# Altium schematic sheet 5DPD8_v1.0_OS_Sheet2.SchDoc: 5DPD8 Controller
size A4; Date: 10th Mar 14; CheckedBy: J. Wong/C. Lai; CompanyName: Makible Ltd.; DrawnBy: Martyn Kay; Engineer: Martyn Kay; Revision: 1.0; SheetNumber: 2; SheetTotal: 4; Website: 5DPrint.com; DesignFileLink: D8 Design Files; BasedOn: Printrboard Rev. B; OSHWLicense: CC BY-SA 4.0
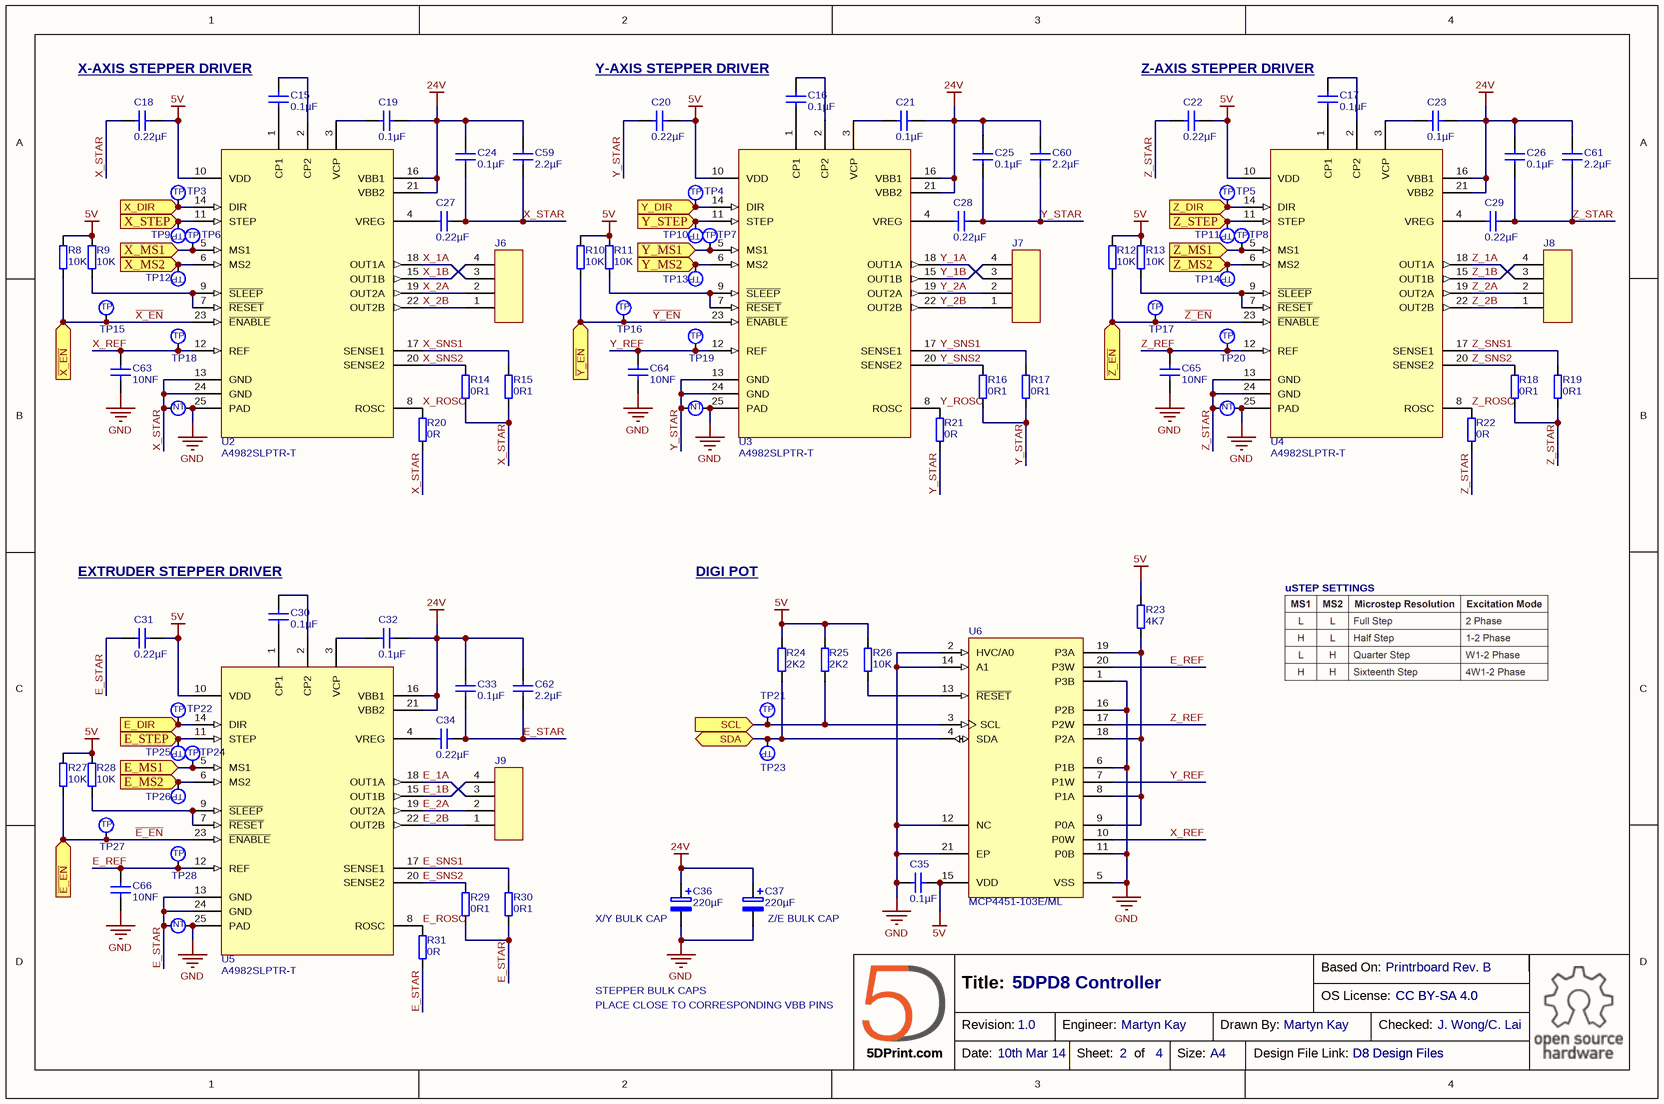
[diagram p0: 5DPD8_v1.0_OS_Sheet2.SchDoc]

## Parts
C15  0.1µF  [CAPC0603(1608)100_N]
C16  0.1µF  [CAPC0603(1608)100_N]
C17  0.1µF  [CAPC0603(1608)100_N]
C18  0.22µF  [CAPC0603(1608)100_N]
C19  0.1µF  [CAPC0603(1608)100_N]
C20  0.22µF  [CAPC0603(1608)100_N]
C21  0.1µF  [CAPC0603(1608)100_N]
C22  0.22µF  [CAPC0603(1608)100_N]
C23  0.1µF  [CAPC0603(1608)100_N]
C24  0.1µF  [CAPC0603(1608)100_N]
C25  0.1µF  [CAPC0603(1608)100_N]
C26  0.1µF  [CAPC0603(1608)100_N]
C27  0.22µF  [CAPC0603(1608)100_N]
C28  0.22µF  [CAPC0603(1608)100_N]
C29  0.22µF  [CAPC0603(1608)100_N]
C30  0.1µF  [CAPC0603(1608)100_N]
C31  0.22µF  [CAPC0603(1608)100_N]
C32  0.1µF  [CAPC0603(1608)100_N]
C33  0.1µF  [CAPC0603(1608)100_N]
C34  0.22µF  [CAPC0603(1608)100_N]
C35  0.1µF  [CAPC0603(1608)100_N]
C36  220µF  [CAPRAD8X11.5]
C37  220µF  [CAPRAD8X11.5]
C59  2.2µF  [CAPC0805(2012)145_N]
C60  2.2µF  [CAPC0805(2012)145_N]
C61  2.2µF  [CAPC0805(2012)145_N]
C62  2.2µF  [CAPC0805(2012)145_N]
C63  10NF  [CAPC0603(1608)100_N]
C64  10NF  [CAPC0603(1608)100_N]
C65  10NF  [CAPC0603(1608)100_N]
C66  10NF  [CAPC0603(1608)100_N]
J6  0022272041  [MOLEX_22-27-2041]  (value not drawn)
J7  0022272041  [MOLEX_22-27-2041]  (value not drawn)
J8  0022272041  [MOLEX_22-27-2041]  (value not drawn)
J9  0022272041  [MOLEX_22-27-2041]  (value not drawn)
NT2  NET_TIE  [NET_TIE-PAD]  (value not drawn)  (net tie, no BOM)
NT3  NET_TIE  [NET_TIE-PAD]  (value not drawn)  (net tie, no BOM)
NT4  NET_TIE  [NET_TIE-PAD]  (value not drawn)  (net tie, no BOM)
NT5  NET_TIE  [NET_TIE-PAD]  (value not drawn)  (net tie, no BOM)
R8  10K  [RESC0603(1608)_N]
R9  10K  [RESC0603(1608)_N]
R10  10K  [RESC0603(1608)_N]
R11  10K  [RESC0603(1608)_N]
R12  10K  [RESC0603(1608)_N]
R13  10K  [RESC0603(1608)_N]
R14  0R1  [RESC0805(2012)_L]
R15  0R1  [RESC0805(2012)_L]
R16  0R1  [RESC0805(2012)_L]
R17  0R1  [RESC0805(2012)_L]
R18  0R1  [RESC0805(2012)_L]
R19  0R1  [RESC0805(2012)_L]
R20  0R  [RESC0603(1608)_N]
R21  0R  [RESC0603(1608)_N]
R22  0R  [RESC0603(1608)_N]
R23  4K7  [RESC0603(1608)_N]
R24  2K2  [RESC0603(1608)_N]
R25  2K2  [RESC0603(1608)_N]
R26  10K  [RESC0603(1608)_N]
R27  10K  [RESC0603(1608)_N]
R28  10K  [RESC0603(1608)_N]
R29  0R1  [RESC0805(2012)_L]
R30  0R1  [RESC0805(2012)_L]
R31  0R  [RESC0603(1608)_N]
TP3  TESTPOINT  [TESTPOINT]  (value not drawn)  (no BOM)
TP4  TESTPOINT  [TESTPOINT]  (value not drawn)  (no BOM)
TP5  TESTPOINT  [TESTPOINT]  (value not drawn)  (no BOM)
TP6  TESTPOINT  [TESTPOINT]  (value not drawn)  (no BOM)
TP7  TESTPOINT  [TESTPOINT]  (value not drawn)  (no BOM)
TP8  TESTPOINT  [TESTPOINT]  (value not drawn)  (no BOM)
TP9  TESTPOINT  [TESTPOINT]  (value not drawn)  (no BOM)
TP10  TESTPOINT  [TESTPOINT]  (value not drawn)  (no BOM)
TP11  TESTPOINT  [TESTPOINT]  (value not drawn)  (no BOM)
TP12  TESTPOINT  [TESTPOINT]  (value not drawn)  (no BOM)
TP13  TESTPOINT  [TESTPOINT]  (value not drawn)  (no BOM)
TP14  TESTPOINT  [TESTPOINT]  (value not drawn)  (no BOM)
TP15  TESTPOINT  [TESTPOINT]  (value not drawn)  (no BOM)
TP16  TESTPOINT  [TESTPOINT]  (value not drawn)  (no BOM)
TP17  TESTPOINT  [TESTPOINT]  (value not drawn)  (no BOM)
TP18  TESTPOINT  [TESTPOINT]  (value not drawn)  (no BOM)
TP19  TESTPOINT  [TESTPOINT]  (value not drawn)  (no BOM)
TP20  TESTPOINT  [TESTPOINT]  (value not drawn)  (no BOM)
TP21  TESTPOINT  [TESTPOINT]  (value not drawn)  (no BOM)
TP22  TESTPOINT  [TESTPOINT]  (value not drawn)  (no BOM)
TP23  TESTPOINT  [TESTPOINT]  (value not drawn)  (no BOM)
TP24  TESTPOINT  [TESTPOINT]  (value not drawn)  (no BOM)
TP25  TESTPOINT  [TESTPOINT]  (value not drawn)  (no BOM)
TP26  TESTPOINT  [TESTPOINT]  (value not drawn)  (no BOM)
TP27  TESTPOINT  [TESTPOINT]  (value not drawn)  (no BOM)
TP28  TESTPOINT  [TESTPOINT]  (value not drawn)  (no BOM)
U2  A4982SLPTR-T  [TSOP65P640X120_HS-25N]
U3  A4982SLPTR-T  [TSOP65P640X120_HS-25N]
U4  A4982SLPTR-T  [TSOP65P640X120_HS-25N]
U5  A4982SLPTR-T  [TSOP65P640X120_HS-25N]
U6  MCP4451-103E/ML  [QFN-ML20_N]

## Ports
E_DIR (in), E_MS1 (in), E_MS2 (in), E_STEP (in), SCL (in), SDA (bidir), X_DIR (in), X_MS1 (in), X_MS2 (in), X_STEP (in), Y_DIR (in), Y_MS1 (in), Y_MS2 (in), Y_STEP (in), Z_DIR (in), Z_MS1 (in), Z_MS2 (in), Z_STEP (in), ~{E_EN} (in), ~{X_EN} (in), ~{Y_EN} (in), ~{Z_EN} (in)

## Nets
5V: C18.2 C20.2 C22.2 C31.2 C35.2 R8.2 R9.2 R10.2 R11.2 R12.2 R13.2 R23.2 R24.2 R25.2 R26.2 R27.2 R28.2 U2.10(VDD) U3.10(VDD) U4.10(VDD) U5.10(VDD) U6.15(VDD)
24V: C19.1 C21.1 C23.1 C24.2 C25.2 C26.2 C32.1 C33.2 C36.1(+) C37.1(+) C59.2 C60.2 C61.2 C62.2 U2.16(VBB1) U2.21(VBB2) U3.16(VBB1) U3.21(VBB2) U4.16(VBB1) U4.21(VBB2) U5.16(VBB1) U5.21(VBB2)
GND: C35.1 C36.2(-) C37.2(-) C63.1 C64.1 C65.1 C66.1 NT2.2 NT3.2 NT4.2 NT5.2 U2.25(PAD) U3.25(PAD) U4.25(PAD) U5.25(PAD) U6.1(P3B) U6.2(HVC/A0) U6.5(VSS) U6.6(P1B) U6.11(P0B) U6.12(NC) U6.14(A1) U6.16(P2B) U6.21(EP)
~{E_EN}: R27.1 TP27.1 U5.23(~{ENABLE}) ; port ~{E_EN}
E_1A: J9.3 U5.18(OUT1A)
E_1B: J9.4 U5.15(OUT1B)
E_2A: J9.2 U5.19(OUT2A)
E_2B: J9.1 U5.22(OUT2B)
E_DIR: TP22.1 U5.14(DIR) ; port E_DIR
E_MS1: TP24.1 U5.5(MS1) ; port E_MS1
E_MS2: TP26.1 U5.6(MS2) ; port E_MS2
E_REF: C66.2 TP28.1 U5.12(REF) U6.20(P3W)
E_ROSC: R31.2 U5.8(ROSC)
E_SNS1: R30.2 U5.17(SENSE1)
E_SNS2: R29.2 U5.20(SENSE2)
E_STAR: C31.1 C33.1 C34.2 C62.1 NT5.1 R29.1 R30.1 R31.1 U5.13(GND) U5.24(GND)
E_STEP: TP25.1 U5.11(STEP) ; port E_STEP
SCL: R25.1 TP21.1 U6.3(SCL) ; port SCL
SDA: R24.1 TP23.1 U6.4(SDA) ; port SDA
~{X_EN}: R8.1 TP15.1 U2.23(~{ENABLE}) ; port ~{X_EN}
X_1A: J6.3 U2.18(OUT1A)
X_1B: J6.4 U2.15(OUT1B)
X_2A: J6.2 U2.19(OUT2A)
X_2B: J6.1 U2.22(OUT2B)
X_DIR: TP3.1 U2.14(DIR) ; port X_DIR
X_MS1: TP6.1 U2.5(MS1) ; port X_MS1
X_MS2: TP12.1 U2.6(MS2) ; port X_MS2
X_REF: C63.2 TP18.1 U2.12(REF) U6.10(P0W)
X_ROSC: R20.2 U2.8(ROSC)
X_SNS1: R15.2 U2.17(SENSE1)
X_SNS2: R14.2 U2.20(SENSE2)
X_STAR: C18.1 C24.1 C27.2 C59.1 NT2.1 R14.1 R15.1 R20.1 U2.13(GND) U2.24(GND)
X_STEP: TP9.1 U2.11(STEP) ; port X_STEP
~{Y_EN}: R10.1 TP16.1 U3.23(~{ENABLE}) ; port ~{Y_EN}
Y_1A: J7.3 U3.18(OUT1A)
Y_1B: J7.4 U3.15(OUT1B)
Y_2A: J7.2 U3.19(OUT2A)
Y_2B: J7.1 U3.22(OUT2B)
Y_DIR: TP4.1 U3.14(DIR) ; port Y_DIR
Y_MS1: TP7.1 U3.5(MS1) ; port Y_MS1
Y_MS2: TP13.1 U3.6(MS2) ; port Y_MS2
Y_REF: C64.2 TP19.1 U3.12(REF) U6.7(P1W)
Y_ROSC: R21.2 U3.8(ROSC)
Y_SNS1: R17.2 U3.17(SENSE1)
Y_SNS2: R16.2 U3.20(SENSE2)
Y_STAR: C20.1 C25.1 C28.2 C60.1 NT3.1 R16.1 R17.1 R21.1 U3.13(GND) U3.24(GND)
Y_STEP: TP10.1 U3.11(STEP) ; port Y_STEP
~{Z_EN}: R12.1 TP17.1 U4.23(~{ENABLE}) ; port ~{Z_EN}
Z_1A: J8.3 U4.18(OUT1A)
Z_1B: J8.4 U4.15(OUT1B)
Z_2A: J8.2 U4.19(OUT2A)
Z_2B: J8.1 U4.22(OUT2B)
Z_DIR: TP5.1 U4.14(DIR) ; port Z_DIR
Z_MS1: TP8.1 U4.5(MS1) ; port Z_MS1
Z_MS2: TP14.1 U4.6(MS2) ; port Z_MS2
Z_REF: C65.2 TP20.1 U4.12(REF) U6.17(P2W)
Z_ROSC: R22.2 U4.8(ROSC)
Z_SNS1: R19.2 U4.17(SENSE1)
Z_SNS2: R18.2 U4.20(SENSE2)
Z_STAR: C22.1 C26.1 C29.2 C61.1 NT4.1 R18.1 R19.1 R22.1 U4.13(GND) U4.24(GND)
Z_STEP: TP11.1 U4.11(STEP) ; port Z_STEP
NetC15_1: C15.1 U2.2(CP2)
NetC15_2: C15.2 U2.1(CP1)
NetC16_1: C16.1 U3.2(CP2)
NetC16_2: C16.2 U3.1(CP1)
NetC17_1: C17.1 U4.2(CP2)
NetC17_2: C17.2 U4.1(CP1)
NetC19_2: C19.2 U2.3(VCP)
NetC21_2: C21.2 U3.3(VCP)
NetC23_2: C23.2 U4.3(VCP)
NetC27_1: C27.1 U2.4(VREG)
NetC28_1: C28.1 U3.4(VREG)
NetC29_1: C29.1 U4.4(VREG)
NetC30_1: C30.1 U5.2(CP2)
NetC30_2: C30.2 U5.1(CP1)
NetC32_2: C32.2 U5.3(VCP)
NetC34_1: C34.1 U5.4(VREG)
NetR9_1: R9.1 U2.7(~{RESET}) U2.9(~{SLEEP})
NetR11_1: R11.1 U3.7(~{RESET}) U3.9(~{SLEEP})
NetR13_1: R13.1 U4.7(~{RESET}) U4.9(~{SLEEP})
NetR23_1: R23.1 U6.8(P1A) U6.9(P0A) U6.18(P2A) U6.19(P3A)
NetR26_1: R26.1 U6.13(~{RESET})
NetR28_1: R28.1 U5.7(~{RESET}) U5.9(~{SLEEP})

## Notes on the sheet
- X-AXIS STEPPER DRIVER
- Y-AXIS STEPPER DRIVER
- Z-AXIS STEPPER DRIVER
- EXTRUDER STEPPER DRIVER
- DIGI POT
- uSTEP SETTINGS
- (near C36) X/Y BULK CAP
- (near C37) Z/E BULK CAP
- PLACE CLOSE TO CORRESPONDING VBB PINS
- STEPPER BULK CAPS
- Based On:
- Title:
- Revision:
- Engineer:
- Drawn By:
- OS License:
- Checked:
- Date:
- Sheet:
- of
- Size:
- A4
- Design File Link:
- (in symbol NET_TIE) NT
- (in symbol TESTPOINT) TP

## Library data of the parts
C15-C17 C19 C21 C23-C26 C30 C32 C33 C35 = C0603-0.1UF-50V-10%-X7R: CAP CER 0.1UF 50V 10% X7R 0603; Manufacturer: Yageo; ManufacturerPartNumber: CC0603KRX7R9BB104; Supplier 1: Digi-Key; RoHS: RoHS Compliant; Category: Capacitors; Stock 1: 2096000; Pricing 1: 4000=0.00513, 8000=0.00468, 12000=0.00446, 28000=0.00424, 100000=0.00307 (USD); Packaging: Tape & Reel (TR); Capacitance: 0.1µF; Voltage - Rated: 50V; Tolerance: ±10%; Temperature Coefficient: X7R; Mounting Type: Surface Mount, MLCC; Operating Temperature: -55°C ~ 125°C; Applications: General Purpose; Ratings: -; Package / Case: 0603 (1608 Metric); Size / Dimension: 0.063" L x 0.031" W (1.60mm x 0.80mm); Height - Seated (Max): -; Thickness (Max): 0.035" (0.90mm); Lead Spacing: -; Features: -; Lead Style: -; ComponentLink1URL: http://www.yageo.com/documents/recent/UPY-GPHC_X7R_6.3V-to-50V_8.pdf; ComponentLink1Description: http://www.yageo.com/documents/recent/UPY-GPHC_X7R_6.3V-to-50V_8.pdf; Supplier Part Number 1: 311-1344-2-ND
C18 C20 C22 C27-C29 C31 C34 = C0603-0.22UF-50V-10%-X7R: CAP CER 0.22UF 50V 10% X7R 0603; Manufacturer: TDK Corporation; ManufacturerPartNumber: C1608X7R1H224K080AB; Supplier 1: Digi-Key; RoHS: RoHS Compliant; Category: Capacitors; Stock 1: 116000; Pricing 1: 4000=0.03, 8000=0.0285, 12000=0.027, 28000=0.0255, 100000=0.02025 (USD); Packaging: Tape & Reel (TR); Capacitance: 0.22µF; Voltage - Rated: 50V; Tolerance: ±10%; Temperature Coefficient: X7R; Mounting Type: Surface Mount, MLCC; Operating Temperature: -55°C ~ 125°C; Applications: General Purpose; Ratings: -; Package / Case: 0603 (1608 Metric); Size / Dimension: 0.063" L x 0.031" W (1.60mm x 0.80mm); Height - Seated (Max): -; Thickness (Max): 0.035" (0.90mm); Lead Spacing: -; Features: -; Lead Style: -; ComponentLink1URL: http://product.tdk.com/capacitor/mlcc/en/documents/mlcc_commercial_general_en.pdf; ComponentLink1Description: http://product.tdk.com/capacitor/mlcc/en/documents/mlcc_commercial_general_en.pdf; Supplier Part Number 1: 445-7408-2-ND
C36 C37 = CAP_RAD-ALU-220UF-35V-20%: CAP ALUM 220UF 35V 20% RADIAL; Manufacturer: Rubycon; ManufacturerPartNumber: 35ZLH220MEFC8X11.5; Lifetime @ Temp.: 8000 Hrs @ 105°C; Ripple Current: 945mA; Impedance: 56 mOhm; Supplier 1: Digi-Key; RoHS: RoHS Compliant; Category: Capacitors; Stock 1: 40821; Pricing 1: 1=0.41, 10=0.288, 25=0.2456, 50=0.2176, 100=0.1895, 250=0.16148, 500=0.1404, 1000=0.11934, 2500=0.11232 (USD); Packaging: Bulk; Capacitance: 220µF; Voltage Rating: 35V; Tolerance: ±20%; ESR (Equivalent Series Resistance): -; Operating Temperature: -40°C ~ 105°C; Type: -; Applications: General Purpose; Lead Spacing: 0.138" (3.50mm); Size / Dimension: 0.315" Dia (8.00mm); Height - Seated (Max): 0.512" (13.00mm); Surface Mount Land Size: -; Mounting Type: Through Hole; Package / Case: Radial, Can; ComponentLink1URL: http://www.rubycon.co.jp/EN/CATALOG/E_PDFS/ALUMINUM/E_ZLH.PDF; ComponentLink1Description: http://www.rubycon.co.jp/EN/CATALOG/E_PDFS/ALUMINUM/E_ZLH.PDF; Supplier Part Number 1: 1189-1863-ND
C59-C62 = C0805-2.2UF-50V-10%-X7R: CAP CER 2.2UF 50V 10% X7R 0805; Manufacturer: Taiyo Yuden; ManufacturerPartNumber: UMK212BB7225KG-T; Supplier 1: Digi-Key; RoHS: RoHS Compliant; Category: Capacitors; Stock 1: 0; Pricing 1: 3000=0.05, 6000=0.04625, 9000=0.04375, 15000=0.0415, 30000=0.04, 75000=0.0375, 150000=0.03313 (USD); Packaging: Tape & Reel (TR); Capacitance: 2.2µF; Voltage - Rated: 50V; Tolerance: ±10%; Temperature Coefficient: X7R; Mounting Type: Surface Mount, MLCC; Operating Temperature: -55°C ~ 125°C; Applications: General Purpose; Ratings: -; Package / Case: 0805 (2012 Metric); Size / Dimension: 0.079" L x 0.049" W (2.00mm x 1.25mm); Height - Seated (Max): -; Thickness (Max): 0.057" (1.45mm); Lead Spacing: -; Features: -; Lead Style: -; Supplier Part Number 1: 587-3169-2-ND
C63-C66 = C0603-10NF-50V-10%-X7R: CAP CER 10000PF 50V 10% X7R 0603; Manufacturer: Yageo; ManufacturerPartNumber: CC0603KPX7R9BB103; Supplier 1: Digi-Key; RoHS: RoHS Compliant; Category: Capacitors; Stock 1: 15000; Pricing 1: 15000=0.003, 30000=0.00285, 75000=0.00255, 105000=0.00206 (USD); Packaging: Tape & Reel (TR); Capacitance: 10NF; Voltage - Rated: 50V; Tolerance: ±10%; Temperature Coefficient: X7R; Mounting Type: Surface Mount, MLCC; Operating Temperature: -55°C ~ 125°C; Applications: General Purpose; Ratings: -; Package / Case: 0603 (1608 Metric); Size / Dimension: 0.063" L x 0.031" W (1.60mm x 0.80mm); Height - Seated (Max): -; Thickness (Max): 0.035" (0.90mm); Lead Spacing: -; Features: -; Lead Style: -; ComponentLink1URL: http://www.yageo.com/documents/recent/UPY-GPHC_X7R_6.3V-to-50V_8.pdf; ComponentLink1Description: http://www.yageo.com/documents/recent/UPY-GPHC_X7R_6.3V-to-50V_8.pdf; Supplier Part Number 1: 311-1572-2-ND
J6-J9 = CON_MLX_22-27-2041: CONN HEADER 4POS .100 VERT TIN; Manufacturer: Molex Inc; Connector Type: Header, Unshrouded; Number of Positions: 4; Number of Positions Loaded: All; Pitch: 0.100" (2.54mm); Supplier 1: Digi-Key; ManufacturerPartNumber: 0022272041; RoHS: RoHS Compliant; Category: Connectors, Interconnects; Stock 1: 8074; Pricing 1: 1=0.42, 10=0.397, 25=0.3572, 50=0.3176, 100=0.3043, 250=0.27784, 500=0.2646, 1000=0.2183, 2500=0.19845 (USD); Packaging: Bulk; Contact Type: Male Pin; Number of Rows: 1; Row Spacing: -; Contact Mating Length: 0.295" (7.49mm); Mounting Type: Through Hole; Termination: Solder; Fastening Type: Friction Lock; Features: -; Contact Finish: Tin; Contact Finish Thickness: 100µin (2.54µm); Color: Natural; ComponentLink1URL: http://www.molex.com/pdm_docs/sd/022272041_sd.pdf; ComponentLink1Description: http://www.molex.com/pdm_docs/sd/022272041_sd.pdf; Supplier Part Number 1: WM4113-ND
NT2-NT5 = NET_TIE: NET TIE
R8-R13 R26-R28 = R0603-10K-0.1W-5%: RES 10K OHM 1/10W 5% 0603 SMD; Manufacturer: Yageo; ManufacturerPartNumber: RC0603JR-0710KL; Power (Watts): 0.1W, 1/10W; Temperature Coefficient: ±100ppm/°C; Supplier 1: Digi-Key; RoHS: RoHS Compliant; Category: Resistors; Stock 1: 0; Pricing 1: 5000=0.00131, 10000=0.00114, 25000=0.001, 50000=0.00092, 125000=0.0009 (USD); Packaging: Tape & Reel (TR); Resistance: 10K; Tolerance: ±5%; Composition: Thick Film; Features: -; Package / Case: 0603 (1608 Metric); Supplier Device Package: 0603; Size / Dimension: 0.063" L x 0.031" W (1.60mm x 0.80mm); Height: 0.022" (0.55mm); Number of Terminations: 2; ComponentLink1URL: http://www.yageo.com/documents/recent/PYu-RC0603_51_RoHS_L_4.pdf; ComponentLink1Description: http://www.yageo.com/documents/recent/PYu-RC0603_51_RoHS_L_4.pdf; Supplier Part Number 1: 311-10KGRTR-ND
R14-R19 R29 R30 = R0805-0R1-0.5W-1%: RES 0.100 OHM 0.5W 1% 0805; Manufacturer: Susumu; ManufacturerPartNumber: KRL1220E-M-R100-F-T5; Power (Watts): 0.5W, 1/2W; Temperature Coefficient: ±50ppm/°C; Supplier 1: Digi-Key; RoHS: RoHS Compliant; Category: Resistors; Stock 1: 5000; Pricing 1: 5000=0.07965, 10000=0.07788, 25000=0.07523, 50000=0.07375, 125000=0.07304 (USD); Packaging: Tape & Reel (TR); Resistance: 0R1; Tolerance: ±1%; Composition: Metal Foil; Features: Current Sense; Package / Case: 0805 (2012 Metric); Supplier Device Package: 0805; Size / Dimension: 0.079" L x 0.049" W (2.00mm x 1.25mm); Height: 0.028" (0.70mm); Number of Terminations: 2; ComponentLink1URL: http://susumu-usa.com/pdf/KRL_New_Short_Data_sheet.pdf; ComponentLink1Description: http://susumu-usa.com/pdf/KRL_New_Short_Data_sheet.pdf; Supplier Part Number 1: 408-1556-2-ND
R20-R22 R31 = R0603-0R-0.1W-JUMP: RES ZERO OHM 1/10W JUMP 0603 SMD; Manufacturer: Yageo; ManufacturerPartNumber: RC0603JR-070RL; Tolerance: Jumper; Power (Watts): 0.1W, 1/10W; Supplier 1: Digi-Key; RoHS: RoHS Compliant; Category: Resistors; Stock 1: 2065000; Pricing 1: 5000=0.00131, 10000=0.00114, 25000=0.001, 50000=0.00092, 125000=0.0009 (USD); Packaging: Tape & Reel (TR); Resistance: 0R; Composition: Thick Film; Features: -; Temperature Coefficient: -; Package / Case: 0603 (1608 Metric); Supplier Device Package: 0603; Size / Dimension: 0.063" L x 0.031" W (1.60mm x 0.80mm); Height: 0.022" (0.55mm); Number of Terminations: 2; ComponentLink1URL: http://www.yageo.com/documents/recent/PYu-RC0603_51_RoHS_L_4.pdf; ComponentLink1Description: http://www.yageo.com/documents/recent/PYu-RC0603_51_RoHS_L_4.pdf; Supplier Part Number 1: 311-0.0GRTR-ND
R23 = R0603-4K7-0.1W-1%: RES 4.70K OHM 1/10W 1% 0603 SMD; Manufacturer: Yageo; ManufacturerPartNumber: RC0603FR-074K7L; Power (Watts): 0.1W, 1/10W; Temperature Coefficient: ±100ppm/°C; Supplier 1: Digi-Key; RoHS: RoHS Compliant; Category: Resistors; Stock 1: 0; Pricing 1: 5000=0.00171, 10000=0.00149, 25000=0.00131, 50000=0.0012, 125000=0.00117 (USD); Packaging: Tape & Reel (TR); Resistance: 4K7; Tolerance: ±1%; Composition: Thick Film; Features: -; Package / Case: 0603 (1608 Metric); Supplier Device Package: 0603; Size / Dimension: 0.063" L x 0.031" W (1.60mm x 0.80mm); Height: 0.022" (0.55mm); Number of Terminations: 2; ComponentLink1URL: http://www.yageo.com/documents/recent/PYu-RC0603_51_RoHS_L_4.pdf; ComponentLink1Description: http://www.yageo.com/documents/recent/PYu-RC0603_51_RoHS_L_4.pdf; Supplier Part Number 1: 311-4.70KHRTR-ND
R24 R25 = R0603-2K2-0.1W-5%: RES 2.2K OHM 1/10W 5% 0603 SMD; Manufacturer: Yageo; ManufacturerPartNumber: RC0603JR-072K2L; Power (Watts): 0.1W, 1/10W; Temperature Coefficient: ±100ppm/°C; Supplier 1: Digi-Key; RoHS: RoHS Compliant; Category: Resistors; Stock 1: 480000; Pricing 1: 5000=0.00131, 10000=0.00114, 25000=0.001, 50000=0.00092, 125000=0.0009 (USD); Packaging: Tape & Reel (TR); Resistance: 2K2; Tolerance: ±5%; Composition: Thick Film; Features: -; Package / Case: 0603 (1608 Metric); Supplier Device Package: 0603; Size / Dimension: 0.063" L x 0.031" W (1.60mm x 0.80mm); Height: 0.022" (0.55mm); Number of Terminations: 2; ComponentLink1URL: http://www.yageo.com/documents/recent/PYu-RC0603_51_RoHS_L_4.pdf; ComponentLink1Description: http://www.yageo.com/documents/recent/PYu-RC0603_51_RoHS_L_4.pdf; Supplier Part Number 1: 311-2.2KGRTR-ND
U2-U5 = IC_A4982SLPTR-T: IC MOTOR DRIVER PAR 24TSSOP; Manufacturer: Allegro MicroSystems, LLC; Motor Type - Stepper: Bipolar; Motor Type - AC, DC: Brushed DC; Function: Driver - Fully Integrated, Control and Power Stage; Output Configuration: Full H-Bridge, (2) Dual; Interface: Parallel; Current - Output: 2A; Voltage - Supply: 3 V ~ 5.5 V; Voltage - Load: 8 V ~ 35 V; Supplier 1: Digi-Key; ManufacturerPartNumber: A4982SLPTR-T; RoHS: RoHS Compliant; Category: Integrated Circuits (ICs); Stock 1: 4000; Pricing 1: 4000=1.6891, 8000=1.6256, 12000=1.5748, 28000=1.524 (USD); Packaging: Tape & Reel (TR); Applications: General Purpose; Operating Temperature: -20°C ~ 85°C; Mounting Type: Surface Mount; Package / Case: 24-TSSOP (0.173", 4.40mm Width) Exposed Pad; Supplier Device Package: 24-TSSOP-EP; ComponentLink1URL: http://www.allegromicro.com/en/Products/Part_Numbers/4982/4982.pdf; ComponentLink1Description: http://www.allegromicro.com/en/Products/Part_Numbers/4982/4982.pdf; Supplier Part Number 1: 620-1352-2-ND
U6 = IC_MCP4451-103E/ML: IC POT 10K QUAD 8BIT 20QFN; Manufacturer: Microchip Technology; Taps: 257; Number of Circuits: 4; Temperature Coefficient: 150 ppm/°C Typical; Memory Type: Volatile; Interface: I²C (Device Address); Voltage - Supply: 1.8 V ~ 5.5 V; Supplier 1: Digi-Key; ManufacturerPartNumber: MCP4451-103E/ML; RoHS: RoHS Compliant; Category: Integrated Circuits (ICs); Stock 1: 55; Pricing 1: 1=1.62, 10=1.35, 25=1.13, 100=1.02 (USD); Packaging: Tube; Operating Temperature: -40°C ~ 125°C; Mounting Type: Surface Mount; Package / Case: 20-VFQFN Exposed Pad; Supplier Device Package: 20-QFN (4x4); ComponentLink1URL: http://www.microchip.com/mymicrochip/filehandler.aspx?ddocname=en551975; ComponentLink1Description: http://www.microchip.com/mymicrochip/filehandler.aspx?ddocname=en551975; Supplier Part Number 1: MCP4451-103E/ML-ND; Resistance: 10K